# EAGLE board SparkFun_Artemis_Global_Tracker (EAGLE 9.6.2)
REVISION: A
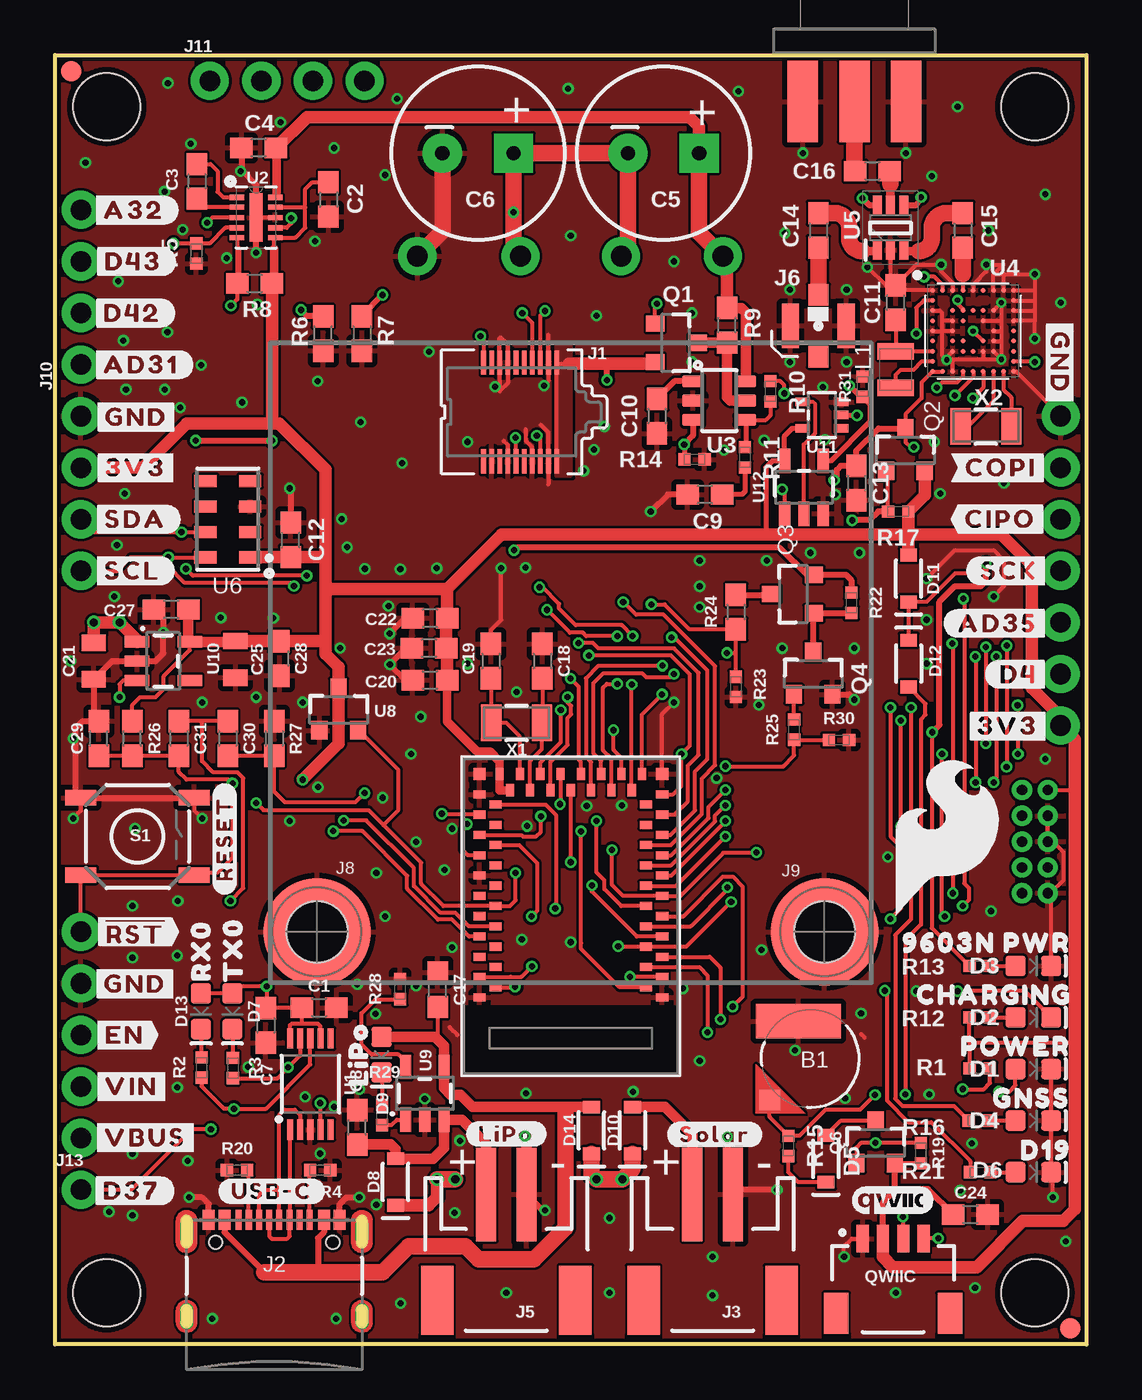
[diagram p2: board, top side]
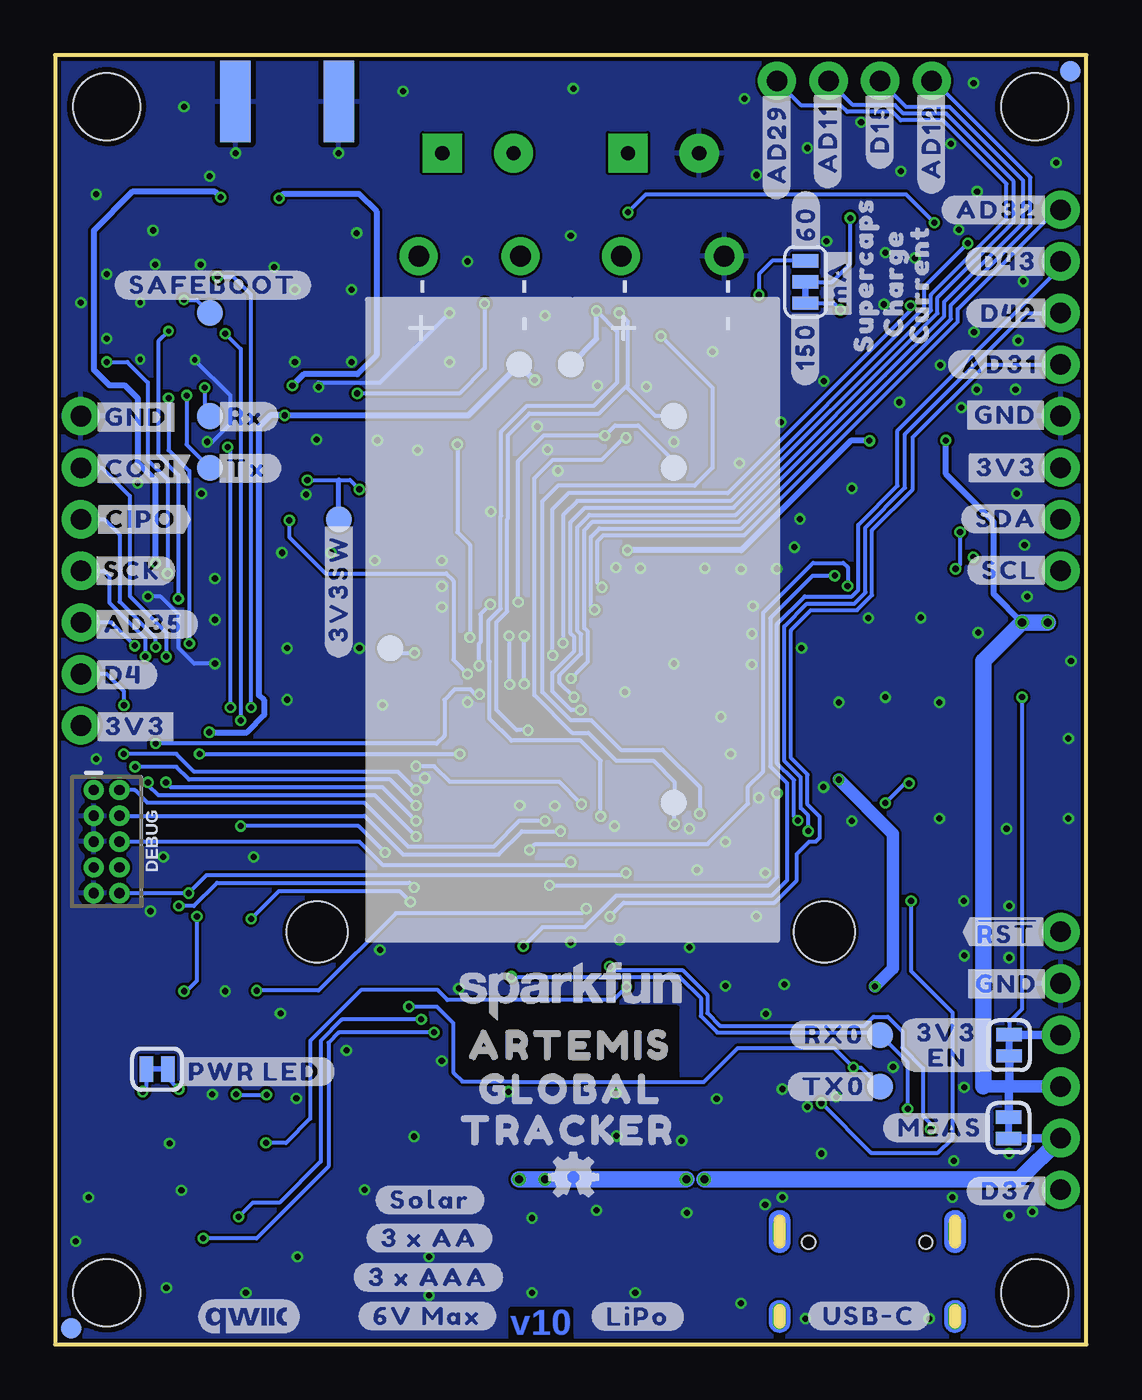
[diagram p3: board, bottom side, seen from below]

Size 50.8 x 63.5 mm. Coordinates in mm from the lower left corner, seen from the top.
Outline: 0,0 0,63.5 50.8,63.5 50.8,0 0,0
Copper layers (1*16): Top 0.035mm / dielectric 1.5mm / Bottom 0.035mm
Design rules "SparkFun-2-Layer-Minimum-JLCPCB": minimum track width 5mil, minimum drill 0.3mm, track to track 5mil, track to pad 5mil, pad to pad 5mil, via to via 5mil, smd to smd 5mil, copper to edge 7mil, drill to drill 7mil, minimum pad ring 5mil, minimum via ring 5mil, stop-mask expansion 2.5mil, vias tented up to drill 25mil, thermal gap 10mil
Net classes: 1 3.3V: width 0.203 mm
tRestrict: area 20.2,13.4 to 30.6,16.6; area 22.1,48.3 to 22.1,48.4
bRestrict: area 20.2,13.4 to 30.6,16.6

## Footprints (pad centres in the part's own frame; a part is rotated, then mirrored left to right if it is on the bottom)
SMT-JUMPER_2_NC_TRACE_SILK = smd 0.66 x 1.27: 1 -0.521,0; 2 0.521,0
PAD.03X.05 = smd 1.27 x 1.27: 1 0,0
1X01_NO_SILK = drill 1.016 pad 1.88: 1 0,0
ML414H_IV01E = smd 1 x 1: + 2.022,2.032 | smd 4.2 x 1.7: - 0.6,-1.85
0603 = smd 1.1 x 1: 1 -0.85,0; 2 0.85,0
CPOL-RADIAL-1F-2.7V = drill 0.7 pad 1.93 square: + 1.75,0 | drill 0.7 pad 1.93: - -1.75,0
0805 = smd 0.8 x 1.2: 1 -0.9,0; 2 0.9,0
LED-0603 = smd 1 x 1: A -0.877,0; C 0.877,0
SOD-323 = smd 0.63 x 0.83: A 1.15,0; C -1.15,0
2X5-PTH-1.27MM-NO_SILK = drill 0.508 pad 1: 1 -2.54,-0.635; 2 -2.54,0.635; 3 -1.27,-0.635; 4 -1.27,0.635; 5 0,-0.635; 6 0,0.635; 7 1.27,-0.635; 8 1.27,0.635; 9 2.54,-0.635; 10 2.54,0.635
1X04_NO_SILK = drill 1.016 pad 1.88: 1 0,0; 2 2.54,0; 3 5.08,0; 4 7.62,0
IRIDIUM_9603N = smd 0.23 x 1.2: 1 1.8,2.435; 2 1.8,-2.435; 3 1.4,2.435; 4 1.4,-2.435; 5 1,2.435; 6 1,-2.435; 7 0.6,2.435; 8 0.6,-2.435; 9 0.2,2.435; 10 0.2,-2.435; 11 -0.2,2.435; 12 -0.2,-2.435; 13 -0.6,2.435; 14 -0.6,-2.435; 15 -1,2.435; 16 -1,-2.435; 17 -1.4,2.435; 18 -1.4,-2.435; 19 -1.8,2.435; 20 -1.8,-2.435
USB-C-16P-2LAYER-PADS = smd 0.3 x 1: A5 -1.25,-0.34; A6 -0.25,-0.34; A7 0.25,-0.34; A8 1.25,-0.34; B5 1.75,-0.34; B6 0.75,-0.34; B7 -0.75,-0.34; B8 -1.75,-0.34 | smd 0.6 x 1: GND -3.225,-0.34; GND2 3.225,-0.34; VBUS1 -2.45,-0.34; VBUS2 2.45,-0.34 | drill 0.4 pad 0.6 long: SHLD1 -4.318,-0.915; SHLD2 4.318,-0.915; SHLD3 -4.318,-5.095; SHLD4 4.318,-5.095 | hole 0.65: -2.89,-1.445; 2.89,-1.445
JST-2-SMD = smd 1 x 4.6: 1 -1,-3.7; 2 1,-3.7 | smd 1.6 x 3.4: NC1 -3.4,1.5; NC2 3.4,1.5
1X02_NO_SILK = drill 1.016 pad 1.88: 1 0,0; 2 2.54,0
U.FL = smd 2.2 x 0.85: 1 0,1.375; 2 0,-1.375 | smd 1.05 x 1: FEED 1.525,0; NC -1.525,0
SMA-EDGE = smd 1.5 x 4: GND@0 -2.54,0; GND@1 2.54,0; SIG 0,0 | smd 1.5 x 4 bottom: GND@2 -2.54,0; GND@3 2.54,0
STAND-OFF-REFLOW-M2.0 = smd 5.3 x 5.3: 1 0,0 | hole 3: 0,0
SMT-JUMPER_3_1-NC_TRACE_SILK = smd 0.66 x 1.27: 1 -1.041,0; 2 0,0; 3 1.041,0
FIDUCIAL-1X2 = smd 1 x 1: 1 0,0
STAND-OFF = hole 3.302: 0,0
0806 = smd 0.8 x 1.8: 1 -0.9,0; 2 0.9,0
SOT23-3 = smd 0.8 x 0.9: 1 -0.95,-1; 2 0.95,-1; 3 0,1.1
JST04_1MM_RA = smd 0.6 x 1.35: 1 -1.5,0; 2 -0.5,0; 3 0.5,0; 4 1.5,0 | smd 1.2 x 2: NC1 2.8,-3.675; NC2 -2.8,-3.675
0402-TIGHT = smd 0.6 x 0.6: 1 -0.5,0; 2 0.5,0
TACTILE_SWITCH_SMD_5.2MM = smd 1.524 x 0.762: 1 -2.794,1.905; 2 2.794,1.905; 3 -2.794,-1.905; 4 2.794,-1.905
1X07_NO_SILK = drill 1.016 pad 1.88: 1 0,0; 2 2.54,0; 3 5.08,0; 4 7.62,0; 5 10.16,0; 6 12.7,0; 7 15.24,0
MSOP10 = smd 1 x 0.3: 1 -2.25,1; 2 -2.25,0.5; 3 -2.25,0; 4 -2.25,-0.5; 5 -2.25,-1; 6 2.25,-1; 7 2.25,-0.5; 8 2.25,0; 9 2.25,0.5; 10 2.25,1
DFN300X200-10L = smd 0.711 x 0.254: 1 -0.94,0.991; 2 -0.94,0.508; 3 -0.94,0; 4 -0.94,-0.508; 5 -0.94,-0.991; 6 0.94,-0.991; 7 0.94,-0.508; 8 0.94,0; 9 0.94,0.508; 10 0.94,0.991 | smd 0.635 x 2.388: 11 0,0
TSOT6 = smd 0.6 x 1.05: 1 -0.95,-1.3; 2 0,-1.3; 3 0.95,-1.3; 4 0.95,1.3; 5 0,1.3; 6 -0.95,1.3
UBLOX_ZOE_M8-0-10 = smd 0.25 x 0.25: 1 -1.996,2.004; 2 -1.496,2.004; 3 -0.996,2.004; 4 -0.496,2.004; 5 0.004,2.004; 6 0.504,2.004; 7 1.004,2.004; 8 1.504,2.004; 9 2.004,2.004; 10 2.004,1.504; 11 2.004,1.004; 12 2.004,0.504; 13 2.004,0.004; 14 2.004,-0.496; 15 2.004,-0.996; 16 2.004,-1.496; 17 2.004,-1.996; 18 1.504,-1.996; 19 1.004,-1.996; 20 0.504,-1.996; 21 0.004,-1.996; 22 -0.496,-1.996; 23 -0.996,-1.996; 24 -1.496,-1.996; 25 -1.996,-1.996; 26 -1.996,-1.496; 27 -1.996,-0.996; 28 -1.996,-0.496; 29 -1.996,0.004; 30 -1.996,0.504; 31 -1.996,1.004; 32 -1.996,1.504; 33 -0.996,1.004; 34 -0.496,1.004; 35 0.004,1.004; 36 0.504,1.004; 37 1.004,1.004; 38 1.004,0.004; 39 1.004,-0.496; 40 1.004,-0.996; 41 0.504,-0.996; 42 0.004,-0.996; 43 -0.496,-0.996; 44 -0.996,-0.996; 45 -0.996,-0.496; 46 -0.996,0.004; 47 -0.996,0.504; 48 -0.496,0.504; 49 0.504,0.504; 50 0.504,-0.496; 51 -0.496,-0.496
SOT65P220X100-6N = smd 0.95 x 0.45: 1 -1.1,0.65; 2 -1.1,0; 3 -1.1,-0.65; 4 1.1,-0.65; 5 1.1,0; 6 1.1,0.65
MS8607-02BA01 = smd 1.1 x 0.6: 1 -1.1,1.875; 2 -1.1,0.625; 3 -1.1,-0.625; 4 -1.1,-1.875; 5 1.1,-1.875; 6 1.1,-0.625; 7 1.1,0.625; 8 1.1,1.875
ARTEMIS_FP = smd 0.4 x 0.6: AD16 -4,-3.7; BOOT 1.5,4.5; D0 0.5,-4.5; D1 -0.5,-4.5; D2 -1,-3.7; D3 2,-3.7; D7 -1.5,4.5; D8 -0.5,4.5; D9 2,3.7; D10 1,3.7; D14 -5,3.7; D17 -3.5,-4.5; D36 2.5,-4.5; D38 3,-3.7; D40 2.5,4.5; D41 -2.5,-4.5; GND@1 4.5,4.5; GND@39 -5.5,-4.5; GND@47 -1.5,-4.5; GND@59 4.5,-4.5; RXI-0 3.5,4.5; SWDCK 4,3.7; SWDIO 0,3.7; TXO-0 0.5,4.5; ~AD31 -3,-3.7; ~AD35 -2,3.7; ~D4 -2.5,4.5; ~D5 -1,3.7; ~D18 -4.5,-4.5; ~D19 -5,-3.7; ~D22 -3.5,4.5; ~D23 -4,3.7; ~D24 -3,3.7; ~D27 -4.5,4.5; ~D28 -5.5,4.5; ~D37 3.5,-4.5; ~D39 3,3.7; ~D42 1.5,-4.5; ~D43 1,-3.7; ~D44 4,-3.7; ~D45 -2,-3.7; ~RST 0,-3.7 | smd 0.6 x 0.4: AD34 -6.5,-0.5; D15 -6.5,0.5; VDD@36 -5.7,-3; VDD@37 -6.5,-3.5; XI -6.5,-2.5; XO -5.7,-2; ~AD11 -5.7,-1; ~AD12 -5.7,2; ~AD13 -5.7,1; ~AD29 -6.5,-1.5; ~AD32 -5.7,3; ~AD33/SWO -5.7,0; ~D6 -6.5,3.5; ~D25 -6.5,2.5; ~D26 -6.5,1.5 | smd 0.6 x 0.6: GND@22 -6.5,4.5; GND@38 -6.5,-4.5
SOT23-5 = smd 0.55 x 1.2: 1 -0.95,-1.3; 2 0,-1.3; 3 0.95,-1.3; 4 0.95,1.3; 5 -0.95,1.3
SOT353 = smd 0.42 x 0.7: 1 -0.65,-0.95; 2 0,-0.95; 3 0.65,-0.95; 4 0.65,0.95; 5 -0.65,0.95
CRYSTAL-SMD-3.2X1.5MM = smd 1 x 1.8: P$1 -1.25,0; P$2 1.25,0

## Placement (x,y rotation side)
3V3EN  JUMPER-SMT_2_NC_TRACE_SILK  [SMT-JUMPER_2_NC_TRACE_SILK]  3.81,14.73 90 bottom
3V3SW  [PAD.03X.05]  36.83,40.64 0 bottom
5V3  TEST-POINT3X5  [PAD.03X.05]  27.94,48.26 0 bottom
!RESET  [1X01_NO_SILK]  1.27,20.32 0 top
B1  ML414H_IV01E_BATTERY  [ML414H_IV01E]  37.21,14.07 180 top
C1  10nF  [0603]  13,16.59 0 top
C2  2.2uF  [0603]  13.46,56.39 270 top
C3  1.0uF  [0603]  6.99,57.28 270 top
C4  0.22uF  [0603]  10.03,58.93 180 top
C5  1F 2.7V  [CPOL-RADIAL-1F-2.7V]  29.97,58.67 0 top
C6  1F 2.7V  [CPOL-RADIAL-1F-2.7V]  20.83,58.67 0 top
C7  0.1uF  [0603]  10.38,15.71 270 top
C8  4.7uF  [0603]  14.88,10.69 90 top
C9  10nF  [0603]  32,41.86 180 top
C10  1.0uF  [0603]  29.64,45.72 270 top
C11  4.7uF  [0603]  41.4,51.31 90 top
C12  0.22uF  [0603]  11.61,39.62 90 top
C13  0.1uF  [0603]  39.47,42.42 270 top
C14  100pF  [0603]  37.59,54.86 270 top
C15  100pF  [0603]  44.7,54.86 270 top
C16  100pF  [0603]  40.26,57.78 0 top
C17  4.7uF  [0603]  18.85,17.48 90 top
C18  15pF  [0603]  24,33.66 270 top
C19  15pF  [0603]  21.46,33.66 270 top
C20  0.1uF  [0603]  18.47,32.72 0 top
C21  22uF  [0805]  1.91,33.66 270 top
C22  10uF  [0603]  18.47,35.76 180 top
C23  1.0uF  [0603]  18.41,34.29 180 top
C24  1.0uF  [0603]  45.09,6.4 0 top
C25  22uF  [0805]  8.89,33.74 270 top
C27  1.0uF  [0603]  5.71,36.2 180 top
C28  0.1uF  [0603]  11.05,33.78 270 top
C29  1nF  [0603]  2.16,29.84 90 top
C30  0.1uF  [0603]  8.51,29.84 270 top
C31  0.1uF  [0603]  6.1,29.84 270 top
D1  GREEN  [LED-0603]  48.18,13.56 0 top
D2  Yellow  [LED-0603]  48.18,16.1 0 top
D3  RED  [LED-0603]  48.18,18.64 0 top
D4  BLUE  [LED-0603]  48.18,11.02 0 top
D5  0.5A/40V/420mV  [SOD-323]  37.97,9.14 90 top
D6  WHITE  [LED-0603]  48.18,8.48 0 top
D7  GREEN  [LED-0603]  8.74,16.41 270 top
D8  0.5A/40V/420mV  [SOD-323]  16.76,8 90 top
D9  Yellow  [LED-0603]  16.08,14.27 270 top
D10  0.5A/40V/420mV  [SOD-323]  28.45,10.54 90 top
D11  0.5A/40V/420mV  [SOD-323]  42.04,37.72 90 top
D12  0.5A/40V/420mV  [SOD-323]  42.04,33.53 270 top
D13  Yellow  [LED-0603]  7.19,16.41 270 top
D14  0.5A/40V/420mV  [SOD-323]  26.42,10.54 90 top
D17  [PAD.03X.05]  25.4,48.26 0 bottom
D41  [PAD.03X.05]  20.32,26.67 0 bottom
DEBUG  CORTEX_DEBUG  [2X5-PTH-1.27MM-NO_SILK]  48.26,24.77 270 bottom
EN  [1X01_NO_SILK]  1.27,15.24 0 top
FRAME3  FRAME-LETTERNO_PACKAGE  [DUMMY]  -7.62,-40.64 0 top  (outside the outline)
FRAME5  FRAME-LEDGER  [CREATIVE_COMMONS]  -7.62,-40.64 0 top  (outside the outline)
GND  [1X01_NO_SILK]  1.27,17.78 0 top
GPS_RX  TEST-POINT3X5  [PAD.03X.05]  43.18,45.72 0 bottom
GPS_TX  TEST-POINT3X5  [PAD.03X.05]  43.18,43.18 0 bottom
I2C  PTH  [1X04_NO_SILK]  1.27,45.72 270 top
J1  IRIDIUM_9603N  [IRIDIUM_9603N]  22.9,45.92 0 top
J2  USB-C  [USB-C-16P-2LAYER-PADS]  10.79,6.48 0 top
J3  [JST-2-SMD]  32.38,3.68 180 top
J4  [1X02_NO_SILK]  1.27,12.7 270 top
J5  [JST-2-SMD]  22.23,3.68 180 top
J6  U.FL  [U.FL]  37.59,50.16 90 top
J7  ANTENNA-GROUNDEDEDGE_SMA  [SMA-EDGE]  39.37,61.21 0 top
J8  STAND-OFF-REFLOW-M2.0_6.0MM_TALL  [STAND-OFF-REFLOW-M2.0]  12.9,20.32 0 top
J9  STAND-OFF-REFLOW-M2.0_6.0MM_TALL  [STAND-OFF-REFLOW-M2.0]  37.9,20.32 0 top
J10  [1X04_NO_SILK]  1.27,48.26 90 top
J11  [1X04_NO_SILK]  7.62,62.23 0 top
J13  [1X01_NO_SILK]  1.27,7.62 0 top
JP1  JUMPER-SMT_3_1-NC_TRACE_SILK  [SMT-JUMPER_3_1-NC_TRACE_SILK]  13.84,52.32 270 bottom
JP2  JUMPER-SMT_2_NC_TRACE_SILK  [SMT-JUMPER_2_NC_TRACE_SILK]  45.77,13.56 0 bottom
JP7  FIDUCIAL1X2  [FIDUCIAL-1X2]  0.79,62.71 0 bottom
JP8  FIDUCIAL1X2  [FIDUCIAL-1X2]  50.01,0.79 0 top
JP9  STAND-OFF  [STAND-OFF]  2.54,60.96 0 top
JP10  STAND-OFF  [STAND-OFF]  48.26,60.96 0 top
JP11  STAND-OFF  [STAND-OFF]  2.54,2.54 0 top
JP12  STAND-OFF  [STAND-OFF]  48.26,2.54 0 top
JP13  FIDUCIAL1X2  [FIDUCIAL-1X2]  50.01,0.79 0 bottom
JP14  FIDUCIAL1X2  [FIDUCIAL-1X2]  0.79,62.71 0 top
L1  2.2uH  [0806]  41.4,48.01 270 top
LOGO1  SFE_LOGO_NAME.1_INCH  [SFE_LOGO_NAME_.1]  25.4,17.4 0 bottom
LOGO2  SFE_LOGO_FLAME.3_INCH  [SFE_LOGO_FLAME_.3]  43.95,24.93 0 top
LOGO4  OSHW-LOGOMINI  [OSHW-LOGO-MINI]  25.27,8.26 0 bottom
MEAS  JUMPER-SMT_2_NC_TRACE_SILK  [SMT-JUMPER_2_NC_TRACE_SILK]  3.84,10.67 90 bottom
Q1  5.8A/30V/35mΩ  [SOT23-3]  30.56,49.33 270 top
Q2  20V/4.2A/52mΩ/1.4W  [SOT23-3]  41.88,44.02 0 top
Q3  20V/4.2A/52mΩ/1.4W  [SOT23-3]  36.37,36.96 90 top
Q4  600mA/40V  [SOT23-3]  37.34,33.02 0 top
Q6  20V/4.2A/52mΩ/1.4W  [SOT23-3]  40.41,9.93 0 top
QWIIC  QWIIC_RA  [JST04_1MM_RA]  41.27,5.21 0 top
R1  330  [0402-TIGHT]  45.54,13.59 180 top
R2  1k  [0402-TIGHT]  7.21,13.64 90 top
R3  1k  [0402-TIGHT]  8.76,13.61 90 top
R4  5.1k  [0402-TIGHT]  13.06,8.59 180 top
R5  10K  [0402-TIGHT]  6.96,53.72 90 top
R6  12k  [0603]  13.21,49.78 90 top
R7  30.1k  [0603]  15.11,49.78 270 top
R8  100k  [0603]  9.83,52.25 0 top
R9  0.015ohm  [0603]  33.1,50.19 90 top
R10  100  [0402-TIGHT]  35.23,46.94 270 top
R11  100  [0402-TIGHT]  33.99,43.69 270 top
R12  1k  [0402-TIGHT]  45.54,16.1 180 top
R13  2.0K  [0402-TIGHT]  45.54,18.64 180 top
R14  10K  [0402-TIGHT]  31.5,43.59 0 top
R15  3.3K  [0402-TIGHT]  36.12,9.78 270 top
R16  1k  [0402-TIGHT]  45.49,11.02 180 top
R17  10K  [0402-TIGHT]  41.53,41.02 0 top
R19  10K  [0402-TIGHT]  42.65,9.42 270 top
R20  5.1k  [0402-TIGHT]  8.97,8.59 0 top
R21  1k  [0402-TIGHT]  45.57,8.48 180 top
R22  10K  [0402-TIGHT]  39.22,36.53 90 top
R23  10K  [0402-TIGHT]  33.53,32.38 270 top
R24  20k  [0603]  33.53,36.07 270 top
R25  1k  [0402-TIGHT]  36.4,30.28 90 top
R26  100k  [0603]  3.81,29.84 90 top
R27  220k  [0603]  10.79,29.84 270 top
R28  2.0K  [0402-TIGHT]  16.99,17.5 270 top
R29  1k  [0402-TIGHT]  16.1,11.3 90 top
R30  10K  [0402-TIGHT]  38.61,29.77 0 top
R31  20k  [0402-TIGHT]  39.78,47.17 90 top
RX0  TEST-POINT3X5  [PAD.03X.05]  10.16,15.24 0 bottom
RX1  TEST-POINT3X5  [PAD.03X.05]  20.32,45.72 0 bottom
S1  RESET  [TACTILE_SWITCH_SMD_5.2MM]  4.06,25.02 0 top
SAFEBOOT  TEST-POINT3X5  [PAD.03X.05]  43.18,50.8 0 bottom
SC1+  [1X01_NO_SILK]  32.89,53.59 0 top
SC1-  [1X01_NO_SILK]  27.88,53.59 0 top
SC2+  [1X01_NO_SILK]  22.92,53.59 0 top
SC2-  [1X01_NO_SILK]  17.84,53.59 0 top
SPI  [1X07_NO_SILK]  49.53,45.72 270 top
TX0  TEST-POINT3X5  [PAD.03X.05]  10.16,12.7 0 bottom
TX1  TEST-POINT3X5  [PAD.03X.05]  20.32,43.18 0 bottom
U1  CH340E_MSOP10  [MSOP10]  12.57,12.83 90 top
U2  LTC3225EDDB  [DFN300X200-10L]  9.91,55.5 0 top
U3  ADM4210_1TSOT6  [TSOT6]  32.72,46.48 270 top
U4  u-blox_ZOE_M8Q-0-10  [UBLOX_ZOE_M8-0-10]  45.21,49.91 0 top
U5  AS179-92LF  [SOT65P220X100-6N]  41.15,54.99 90 top
U6  MS8607-02BA01  [MS8607-02BA01]  8.51,40.64 180 top
U7  ARTEMIS_MODULESMD  [ARTEMIS_FP]  25.4,21.59 270 top
U8  V_SUPERVISOR_BD48K24G_2.4V  [SOT23-3]  13.97,31.24 0 top
U9  MCP73831  [SOT23-5]  18.21,12.37 0 top
U10  3.3V  [SOT23-5]  5.33,33.66 270 top
U11  74LVC1G04SE  [SOT353]  37.77,45.77 90 top
U12  74LVC1G08W5-7  [SOT23-5]  36.88,42.21 0 top
U$1  [SUPERCAPACITOR151]  32.05,35.59 90 bottom
U$2  [#SCK#199608]  46.99,38.1 0 bottom
U$3  [#3V3#0]  3.94,43.18 0 bottom
U$4  [#SDA#0]  3.94,40.67 0 bottom
U$5  [#USB#C#0]  10.72,1.4 0 bottom
U$6  [#SCL#0]  3.78,38.13 0 bottom
U$7  [#VIN#158]  3.76,12.7 0 top
U$8  [#3V3SW#0]  36.83,37.24 90 bottom
U$9  [CHARGING9604]  46.26,17.22 0 top
U$10  [#COPI#9694]  46.58,43.18 0 top
U$11  [QWIIC_4MM]  41.26,7.09 0 top
U$12  [LIPO5]  14.94,14.3 90 top
U$13  [SUPERCAPACITOR151]  22.07,35.99 90 bottom
U$14  [10F_2#7V152]  29.41,35.94 90 bottom
U$15  [10F_2#7V152]  19.48,35.64 90 bottom
U$16  [RX06]  7.2,19.41 90 top
U$17  [#3V3#153]  3.96,43.18 0 top
U$18  [TX07]  8.77,19.44 90 top
U$19  [#AD35#199609]  46.43,35.51 0 top
U$20  [#GND#0]  46.81,45.67 0 bottom
U$21  [#SDA#153]  3.96,40.64 0 top
U$22  [#SCL#154]  3.81,38.1 0 top
U$24  [#AD31#7]  4.24,48.25 0 top
U$25  [QWIIC_5MM]  41.27,1.4 0 bottom
U$26  [#_RST##156]  3.78,20.32 0 top
U$27  [#EN#157]  3.43,15.24 0 top
U$28  [#VIN#3#0]  34.32,31.29 90 bottom
U$29  [#AD35#0]  46.43,35.48 0 bottom
U$30  [ARTEMIS0]  25.4,14.73 0 bottom
U$31  [SUPERCAPS6]  10.97,52.68 90 bottom
U$32  [#D17#0]  23.37,48.21 0 bottom
U$33  [#SAFEBOOT#0]  43.03,52.17 0 bottom
U$34  [#TX0#0]  12.45,12.7 0 bottom
U$35  [#TX1#0]  18.08,43.15 0 bottom
U$36  [#GND#0]  3.99,45.77 0 bottom
U$37  [#RX#0]  41.4,45.69 0 bottom
U$38  [#RX1#0]  18.14,45.67 0 bottom
U$39  [#TX#0]  41.35,43.15 0 bottom
U$40  [#5#3V#0]  27.97,45.85 90 bottom
U$41  [#D41#0]  18.19,26.62 0 bottom
U$42  [#RX0#0]  12.42,15.24 0 bottom
U$43  [#3V3#0]  46.84,30.43 0 bottom
U$44  [#RESET#162]  8.36,24.89 90 top
U$45  [#SOLAR#165]  32.49,10.34 0 top
U$46  [#LIPO#164]  22.23,10.36 0 top
U$47  [#MEAS#0]  7.21,10.67 0 bottom
U$48  [#3V3_#0]  6.73,15.34 0 bottom
U$50  [#D4#36]  47.42,32.98 0 bottom
U$51  [GLOBAL0]  25.4,12.57 0 bottom
U$52  [TRACKER0]  25.53,10.54 0 bottom
U$53  [#LIPO#0]  22.1,1.37 0 bottom
U$54  [#_EN_#0]  6.86,14.12 0 bottom
U$55  [#SOLAR#0]  32.33,7.11 0 bottom
U$56  [#USB#C#161]  10.67,7.54 0 top
U$57  [#3_X_AA#0]  32.36,5.23 0 bottom
U$58  [#VBUS#159]  4.45,10.19 0 top
U$59  [#AD32#152]  4.41,55.88 0 bottom
U$60  [#SCK#9696]  46.99,38.1 0 top
U$61  [#PWR_LED#0]  41,13.44 0 bottom
U$63  [#D4#5]  47.45,33 0 top
U$64  [#CIPO#2]  46.56,40.64 0 bottom
U$65  [#3_X_AAA#0]  32.41,3.3 0 bottom
U$66  [#6V_MAX#0]  32.46,1.4 0 bottom
U$67  [CHARGE8]  9.49,52.28 90 bottom
U$69  [CURRENT9]  8.22,52.23 90 bottom
U$70  [#3V3#153]  46.91,30.45 0 top
U$71  [#D42#32]  3.8,50.79 0 top
U$72  [#D37#152]  3.77,7.57 0 top
U$73  [#D43#43]  3.85,53.33 0 top
U$74  [#150#61]  13.86,49.16 90 bottom
U$75  [#COPI#5]  46.58,43.13 0 bottom
U$76  [#GND#152]  3.99,45.67 0 top
U$77  [#GND#152]  3.94,17.75 0 top
U$78  [#GND#152]  49.48,48.36 270 top
U$79  [#A32#44]  3.89,55.86 0 top
U$80  [#MA#45]  12.26,52.25 90 bottom
U$81  [#60#46]  13.82,55.2 90 bottom
U$82  [#D43#151]  3.85,53.33 0 bottom
U$83  [#D42#151]  3.8,50.79 0 bottom
U$84  [#AD31#151]  4.25,48.26 0 bottom
U$85  [#AD12#151]  7.65,59.27 90 bottom
U$86  [#D15#151]  10.18,59.87 90 bottom
U$87  [#AD11#151]  12.74,59.4 90 bottom
U$88  [#AD29#151]  15.26,59.1 90 bottom
U$89  [#CIPO#151]  46.56,40.65 0 top
U$90  [#D37#0]  3.79,7.56 0 bottom
U$91  [#GND#38]  3.93,17.75 0 bottom
U$92  [##RST##39]  3.94,20.33 0 bottom
U$93  [9603N_PWR40]  45.88,19.78 0 top
U$94  [POWER9605]  47.31,14.68 0 top
U$95  [GNSS9606]  48.1,12.12 0 top
U$96  [D199607]  48.8,9.57 0 top
VIN/3  TEST-POINT3X5  [PAD.03X.05]  34.29,34.29 270 bottom
X1  32.768kHz  [CRYSTAL-SMD-3.2X1.5MM]  22.73,30.61 0 top
X2  32.768kHz  [CRYSTAL-SMD-3.2X1.5MM]  45.85,45.21 0 top

## Tracks (layer width: path | path; a pad name or v marks a point on that pad's centre or on a via)
3.3V  (via drill 0.3)
  Top 0.203: 10.79,53.98 10.79,54.46 U2.6 11.84,54.51 12.32,54.99 12.32,56.01 | C2.1 12.66,57.24 12.32,56.9 12.32,56.01 | U2.9 12.32,56.01 | D13.A D7.A 9.08,17.63 v10.41,17.63 10.41,16.6 C7.1 10.4,16.59 C1.1 12.15,15.82 12.17,15.81 | U1.7 13.07,15.67 12.94,15.81 12.17,15.81 | R26.2 3.81,31.5 4.19,31.88 4.95,31.88 5.36,32.28 5.36,32.92 6.63,34.19 U10.5 | DEBUG.1 50.22,27.3 | 45.04,14.86 R12.2 | 50.22,14.86 45.04,14.86 | 45.04,14.86 R1.2 | 41.36,7.67 41.36,7.62 41.36,7.58 | Q6.2 R19.2 | U1.10 11.57,15.71 11.66,15.81 12.17,15.81
  Top 0.254: U11.5 36.31,45.12 35.93,44.74 U12.5 35.32,43.52 35,43.2 35,40.03 35.15,39.88
  Top 0.305: R8.2 10.79,52.36 | QWIIC.2 40.77,6.99 41.36,7.58 | C24.1 42.99,7.64 41.39,7.64 41.36,7.67 | 41.36,7.62 Q6.2
  Top 0.406: 19.32,34.24 C23.1 | 10.79,52.36 10.79,53.98 | U7.VDD@36 21.89,27.29 U7.VDD@37 21.9,28.72 21.41,29.21 20.78,29.21 19.32,30.67 C20.2
  Top 0.508: C27.1 6.57,34.67 U10.5 8.87,34.6 C25.1
  Top 0.61: C20.2 19.32,34.24 | C23.1 19.27,35.71 C22.1 19.32,37.21 | 13.32,37.21 13.31,37.21 13.31,38.77 | 13.32,37.21 19.32,37.21 | D11.A 42.02,38.88 42.02,39.88 | 42.03,39.88 46.61,39.88 48.11,38.37 48.11,32.33 49.53,30.91 SPI.7 50.22,29.79 50.22,27.3 50.22,14.86 50.22,6.66 49.66,6.1 47.68,6.1 45.39,3.81 41.27,3.81 40.77,4.31 QWIIC.2 | 42.02,39.88 42.03,39.88 | I2C.2 4.32,43.18 6.48,45.34 10.68,45.34 | R8.2 10.68,45.34 | 19.32,37.21 21.98,39.88 35.15,39.88 42.02,39.88 | v12.19,27.81 13.97,29.59 U8.3 13.97,33.35 13.32,34 13.32,34.63 | 13.32,34.63 13.32,37.21 | 42.03,39.88 R17.2 42.83,41.82 Q2.2 | 13.31,38.77 13.31,43.07 11.05,45.34 10.68,45.34 | 13.31,38.77 C12.1 U6.1 | 13.32,34.63 C28.1 C25.1
  Bottom 0.61: v12.19,27.81 9.53,25.15 9.53,18.52 v10.41,17.63
3V3SW  (via drill 0.3)
  Top 0.203: U4.24 U4.25 42.67,47.37 42.67,46.6 41.88,45.81 Q2.3 | R16.2 44.28,11.73 41.75,11.73 41.38,12.1 41.38,20.17 42.16,20.95 v42.16,31.37 | v35.81,42.11 35.93,42 U12.1 | Q2.3 41.88,44.45 42.14,44.19 v42.3,44.19
  Top 0.305: Q2.3 40.56,45.11 39.47,44.01 C13.1 38.7,43.27 38.5,43.07 38.5,42.69 v38.38,42.57
  Bottom 0.203: v42.16,31.37 42.16,44.05 v42.3,44.19 | v38.38,42.57 36.83,42.57 36.27,42.57 v35.81,42.11
  Bottom 0.254: 3V3SW.1 36.83,42.57
ANTENNA
  Top 0.813: 39.37,57.82 C16.1 39.37,57.82 | 39.37,57.82 J7.SIG
ARTEMIS_!RESET  (via drill 0.3)
  Top 0.203: C29.1 R26.1 C31.2 6.1,28.19 6.48,27.81 8.56,27.81 v8.74,27.64 8.74,23.98 8,23.24 6.99,23.24 S1.4 S1.3 !RESET.1 | 16.18,25.58 18.03,23.73 18.03,22.68 19.13,21.59 U7.~RST 22.4,21.59 22.68,21.87 v22.68,23.22 | v9.91,26.67 10.26,26.31 15.44,26.31 16.18,25.57 16.18,25.58 | U4.20 45.72,47.11 v45.21,46.61 | v44.19,34.52 44.21,34.49 v44.21,22.24 v44.22,22.23 | U8.2 14.97,30.24 16.89,28.32 16.89,26.29 16.18,25.58
  Bottom 0.203: v9.91,26.67 8.94,27.64 v8.74,27.64 | DEBUG.10 v44.22,22.23 43.34,23.11 22.78,23.11 v22.68,23.22 | v45.21,46.61 45.21,44.04 44.19,43.02 v44.19,34.52
ARTEMIS_!RTS!  (via drill 0.3)
  Top 0.203: 7.15,30.7 7.24,30.61 7.24,28.73 7.8,28.17 8.99,28.17 9.27,27.89 9.27,22.48 v8.64,21.84 | 7.15,30.7 C31.1 | C30.1 7.15,30.7 | U1.4 13.07,11.88 v13.06,11.89
  Bottom 0.203: v13.06,11.89 10.61,9.44 7.31,9.44 6.59,10.15 6.59,16.33 8.64,18.37 v8.64,21.84
ARTEMIS_AD11  (via drill 0.3)
  Top 0.203: U7.~AD11 24.4,28.68 25.24,29.52 25.24,30.85 25.42,31.03 25.42,31.45 25.24,31.63 v25.24,31.88
  Bottom 0.203: v25.24,31.88 25.94,32.58 25.94,32.97 24.89,34.02 24.89,34.97 25.07,35.15 25.07,40.25 24.48,40.85 17.27,40.85 7.33,50.79 7.33,51.56 3.58,55.3 3.58,57.29 6.91,60.61 9.01,60.61 9.43,61.03 11.5,61.03 J11.3
ARTEMIS_AD12  (via drill 0.3)
  Top 0.203: U7.~AD12 27.4,28.86 27,29.26 27,32.35 27.18,32.53 v27.7,32.53 | v27.7,34.88 26.16,34.88 25.99,35.05 25.36,35.05 v24.23,36.19
  Bottom 0.203: v27.7,32.53 v27.7,34.88 | v24.23,36.19 24.4,36.36 24.4,39.77 23.99,40.19 16.99,40.19 6.67,50.51 6.67,51.19 2.76,55.1 2.76,57.48 7.51,62.23 J11.1
ARTEMIS_AD29  (via drill 0.3)
  Top 0.203: U7.~AD29 23.9,28.65 24.91,29.66 v24.91,31.24
  Bottom 0.203: v24.91,31.24 25.38,31.24 26.31,32.17 26.31,33.07 25.22,34.15 25.22,34.83 25.4,35.01 25.4,40.5 24.69,41.21 17.38,41.21 7.66,50.92 7.66,51.69 3.95,55.41 3.95,57.16 7.07,60.28 9.15,60.28 9.57,60.7 11.79,60.7 12.1,61.02 14.03,61.02 J11.4
ARTEMIS_AD31  (via drill 0.3)
  Top 0.203: U7.~AD31 22.86,24.59 23.75,23.7 23.75,21.36 v23.47,21.08
  Bottom 0.203: v23.47,21.08 22.79,21.75 15.37,21.75 14.27,22.86 14.27,24.14 13.65,24.76 13.34,24.76 13.13,24.96 13.13,25.98 13.74,26.59 13.74,28.06 14.56,28.88 14.56,35.18 13.58,36.16 11.3,36.16 10.56,36.9 10.56,40.1 8.55,42.11 8.55,44.67 4.97,48.26 J10.1
ARTEMIS_AD32  (via drill 0.3)
  Top 0.203: U7.~AD32 28.4,32.49 v28.41,32.5 | v28.44,34.89 27.91,35.42 25.64,35.42 24.83,36.23 24.83,36.47 24.01,37.29 v23.86,37.29
  Bottom 0.203: v28.41,32.5 28.41,34.86 v28.44,34.89 | v23.86,37.29 24.07,37.5 24.07,39.57 23.79,39.85 16.86,39.85 6.34,50.37 6.34,50.99 1.45,55.88 J10.4
ARTEMIS_BOOT  (via drill 0.3)
  Top 0.203: C30.2 R27.2 10.79,27.23 11.33,26.69 14.78,26.69 v15.24,27.15 | v26.44,22.61 26.44,22.3 28.65,20.09 U7.BOOT
  Bottom 0.203: v26.44,22.61 15.67,22.61 15.24,23.03 v15.24,27.15
ARTEMIS_D4  (via drill 0.3)
  Top 0.203: v47.41,31.48 47.41,29.1 v47.42,29.08 | U7.~D4 30.34,24.09 32.18,25.93 32.18,26.47 v33.02,27.3
  Bottom 0.203: v33.02,27.3 33.91,28.19 43.94,28.19 44.83,29.08 v47.42,29.08 | v47.41,31.48 47.41,32.17 48.26,33.02 SPI.6
ARTEMIS_D5_SCK  (via drill 0.3)
  Top 0.203: v46.35,33.88 46.35,27.81 v46.23,27.69 | U7.~D5 30.59,22.59 v33.02,25.02
  Bottom 0.203: v33.02,25.02 35.05,27.05 45.72,27.05 46.23,27.56 v46.23,27.69 | SPI.4 48.39,38.1 48.13,37.85 48.13,36.53 46.35,34.76 v46.35,33.88
ARTEMIS_D6_MISO  (via drill 0.3)
  Top 0.203: U7.~D6 28.9,31.02 v29.9,32.02 | v45.85,34.35 v45.85,29.59
  Bottom 0.203: SPI.3 48.39,40.64 47.62,39.88 47.62,36.58 45.85,34.8 v45.85,34.35 | v29.9,32.02 30.11,32.02 30.35,32.26 31.11,32.26 31.62,31.75 31.62,29.97 32,29.59 v45.85,29.59
ARTEMIS_D7_MOSI  (via drill 0.3)
  Top 0.203: v45.32,33.87 45.34,33.86 v45.34,27.69 | U7.D7 30.35,23.09 33.02,25.76 v33.02,25.78
  Bottom 0.203: SPI.2 48.51,43.18 47.12,41.78 47.12,36.85 45.32,35.06 v45.32,33.87 | v33.02,25.78 34.67,27.43 45.09,27.43 v45.34,27.69 | v45.32,33.87
ARTEMIS_D8_SCL  (via drill 0.3)
  Top 0.203: U4.32 42.78,51.41 42.42,51.05 v42.42,49.78 | v41.66,25.53 v41.66,30.73 | v5.58,38.77 U6.8 | I2C.4 3.06,38.1 3.73,38.77 v5.58,38.77 | v27.43,24.36 27.43,22.63 27.97,22.09 U7.D8 30.8,22.09 32.92,24.21 34.52,24.21 v34.54,24.23 | v11.76,37.35 11.61,37.51 6.39,37.51 5.58,38.32 v5.58,38.77
  Bottom 0.203: v42.42,49.78 41.66,49.02 v41.66,30.73 | v34.54,24.23 35.84,25.53 v41.66,25.53 | v27.43,24.36 27.15,24.64 18.66,24.64 16.67,26.63 16.67,27.48 15.92,28.23 15.92,36.04 13.47,38.49 11.98,38.49 11.76,38.27 v11.76,37.35
ARTEMIS_D9_SDA  (via drill 0.3)
  Top 0.203: v6.22,40.01 6.23,40.02 | 6.23,40.02 U6.7 | I2C.3 1.9,40.02 6.23,40.02 | U4.2 43.72,52.17 43.31,52.58 v42.8,52.58 | v41.15,31.37 41.15,25.02 41.66,24.51 41.66,21.46 v41.15,20.95 | v33.3,21.79 31.1,19.59 U7.D9 29.08,19.61 v27.74,19.61 | v6.44,38.2 6.78,37.86 v12.39,37.86
  Bottom 0.203: v42.8,52.58 42.04,52.58 41.15,51.69 v41.15,31.37 | v41.15,20.95 39.78,22.33 33.83,22.33 v33.3,21.79 | v27.74,19.61 26.8,20.55 24.71,20.55 23.16,22.1 15.52,22.1 14.73,22.89 14.73,27.64 15.57,28.47 15.57,35.77 13.48,37.86 v12.39,37.86 | v6.44,38.2 6.22,38.42 v6.22,40.01
ARTEMIS_D10  (via drill 0.25, 0.3)
  Top 0.203: v44.73,36.73 44.78,36.68 44.78,22.71 45.01,22.48 45.01,21.89 v44.7,21.59 | v45.21,49.91 45.71,49.41 U4.50 | U7.D10 31.31,20.59 33.12,22.4 v33.12,22.5
  Bottom 0.203: v45.21,49.91 U4.50 45.72,43.81 44.73,42.82 v44.73,36.73 | v44.7,21.59 43.97,21.59 42.82,22.73 33.35,22.73 v33.12,22.5
ARTEMIS_D13  (via drill 0.3)
  Top 0.203: U7.~AD13 26.4,28.68 26.15,28.93 26.15,32.8 26.78,33.43 v29.92,33.43 | v29.36,36.45 30.02,36.45 31.23,35.24 33.5,35.24 R24.2 | R23.1 33.53,34.06 | 33.53,34.06 33.53,35.18 | v33.1,34.06 33.53,34.06
  Top 0.305: R24.2 33.53,35.18
  Bottom 0.203: v29.36,36.45 29.85,35.96 29.85,34.58 29.92,34.51 v29.92,33.43 | VIN/3.1 34.06,34.06 v33.1,34.06
ARTEMIS_D15  (via drill 0.3)
  Top 0.203: U7.D15 25.9,28.69 25.79,28.8 25.79,32.4 v25.39,32.8
  Bottom 0.203: v25.39,32.8 24.56,33.62 24.56,35.1 24.73,35.27 24.73,40.1 24.32,40.52 17.14,40.52 9.92,47.74 | 9.92,47.74 | 9.92,47.74 7,50.65 7,51.35 3.11,55.24 3.11,57.32 6.73,60.94 8.87,60.94 J11.2
ARTEMIS_D17  (via drill 0.3)
  Top 0.203: J1.5 23.9,50.67 v24.13,50.9 | U7.D17 22.96,25.09 23.03,25.02 23.7,25.02 23.93,25.25 v23.93,26.01
  Bottom 0.203: v24.13,50.9 23.11,49.89 23.11,47.37 24.26,46.23 27.56,46.23 28.83,44.96 28.83,40.81 28.86,40.78 28.86,36.24 29.44,35.66 29.44,33.66 29.39,33.61 29.39,30.81 28.33,29.74 24.92,29.74 23.93,28.75 v23.93,26.01
  Bottom 0.254: D17.1 24.13,49.53 v24.13,50.9
ARTEMIS_D18  (via drill 0.3)
  Top 0.203: v20.95,49.66 21.1,49.8 J1.19 | v19.05,26.14 20.85,26.14 U7.~D18
  Bottom 0.203: v20.95,49.66 18.41,47.12 18.41,43.18 19.3,42.3 26.03,42.3 26.8,41.53 26.8,32.13 25.4,30.73 24.38,30.73 22.94,29.29 20.88,29.29 19.05,27.46 v19.05,26.14
ARTEMIS_D19  (via drill 0.3)
  Top 0.203: v40.87,17.42 40.97,17.32 40.97,12.01 42.04,10.95 43.16,10.95 45.07,9.03 R21.2 | U7.~D19 24.16,26.59 24.66,26.09 24.66,21.49 v24.64,21.46
  Bottom 0.203: v24.64,21.46 24.86,21.24 34.01,21.24 37.82,17.42 v40.87,17.42
ARTEMIS_D22  (via drill 0.3)
  Top 0.203: v30.37,34.82 30.51,34.82 32.13,33.2 32.13,28.83 31.52,28.22 31.52,26.3 30.31,25.09 U7.~D22
  Top 0.254: v30.99,44.32 30.99,43.59 R14.1
  Top 0.305: U3.3 31.41,44.75 v30.99,44.32
  Bottom 0.203: v30.99,44.32 30.99,40.01 30.37,39.38 v30.37,34.82
ARTEMIS_D24  (via drill 0.3)
  Top 0.203: v27.99,36.57 28.62,35.94 29.98,35.94 32.51,33.4 32.51,28.53 31.85,27.87 31.85,26.11 30.33,24.59 U7.~D24 | J1.6 23.9,44.63 23.78,44.76 v23.72,44.76
  Bottom 0.203: TX1.1 20.32,43.51 22.07,45.26 23.22,45.26 v23.72,44.76 26.75,44.76 27.99,43.52 v27.99,36.57
ARTEMIS_D25  (via drill 0.3)
  Top 0.203: U7.~D25 27.9,28.88 27.51,29.28 v27.51,30.25 | v23.01,50.8 23.5,50.32 J1.7
  Bottom 0.203: v23.01,50.8 22.61,50.39 22.61,47.24 22.68,47.17 | 22.68,47.17 24,45.85 27.43,45.85 28.5,44.78 28.5,40.67 28.53,40.65 28.53,36.1 29.06,35.57 29.06,31.25 28.06,30.25 v27.51,30.25 | RX1.1 21.23,45.72 22.68,47.17
ARTEMIS_D26  (via drill 0.3)
  Top 0.203: U7.~D26 26.9,28.73 26.5,29.14 26.5,32.56 26.98,33.04 28.94,33.04 29.12,32.86 30.32,32.86 v30.48,33.02 | R17.1 41.03,42.89 40.93,42.98 Q2.1
  Top 0.305: R17.1 40.55,41.02 40.11,40.59 v39.26,40.59
  Bottom 0.203: v39.26,40.59 39.26,39.77 37.47,37.97 31.54,37.97 31.17,37.61 31.17,33.71 v30.48,33.02
ARTEMIS_D27  (via drill 0.3)
  Top 0.203: U2.4 8.38,54.99 7.61,54.22 R5.2 v5.85,54.22 v5.84,54.23 | v25.78,34.54 26.49,34.54 26.76,34.28 30.49,34.28 31.7,33.07 31.7,29.03 31.17,28.5 31.17,26.75 30.51,26.09 U7.~D27
  Bottom 0.203: v5.84,54.23 8,52.07 8,51.05 17.52,41.54 25.08,41.54 25.78,40.84 v25.78,34.54
ARTEMIS_D28  (via drill 0.3)
  Top 0.203: U2.5 8.97,54.03 9.02,53.98 | D2.C 47.77,17.4 v44.45,17.4 | v43.81,21.08 43.69,21.21 v43.69,29.08 | R8.1 8.98,51.47 v8.66,51.16 | v26.29,33.94 30.32,33.94 31.27,32.99 31.27,29.49 v30.86,29.08 30.84,29.06 30.84,27.48 30.44,27.09 U7.~D28
  Top 0.305: 9.02,53.98 9.02,52.28 R8.1
  Bottom 0.203: v43.81,21.08 43.81,17.91 44.32,17.4 v44.45,17.4 | v43.69,29.08 v30.86,29.08 | v8.66,51.16 8.66,50.93 17.67,41.92 25.51,41.92 26.29,41.15 v26.29,33.94
ARTEMIS_D33  (via drill 0.3)
  Top 0.203: v25.4,23.75 U7.~AD33/SWO
  Bottom 0.203: DEBUG.6 35.81,24.77 34.67,23.62 25.53,23.62 v25.4,23.75
ARTEMIS_D34  (via drill 0.3)
  Top 0.203: U7.AD34 24.9,26.64 v24.87,26.6 | v33.02,28.48 35.87,28.48 36.4,29.01 R25.1 36.41,29.77 R30.1
  Bottom 0.203: v24.87,26.6 25.98,27.71 31.37,27.71 32.13,28.48 v33.02,28.48
ARTEMIS_D35  (via drill 0.3)
  Top 0.203: v46.88,34.41 46.88,28.46 v46.86,28.45 | U7.~AD35 30.34,23.59 32.51,25.77 32.51,26.06 32.99,26.54 v33.02,26.54
  Bottom 0.203: v33.02,26.54 34.29,27.81 44.2,27.81 44.83,28.45 v46.86,28.45 | v46.88,34.41 48.02,35.56 SPI.5
ARTEMIS_D37  (via drill 0.3)
  Top 0.203: U7.~D37 22.43,18.09 22.45,18.11 22.97,18.11 v23.48,18.62 | v7.68,10.6 6.74,10.6 3.76,7.62 J13.1
  Bottom 0.203: v23.48,18.62 23.31,18.44 19.9,18.44 18.67,17.21 18.67,16.32 18.05,15.7 10.93,15.7 10.49,16.14 9.79,16.14 9.08,15.42 9.08,14.63 8.05,13.6 8.05,11.25 7.68,10.88 v7.68,10.6
ARTEMIS_D39_SCL4  (via drill 0.3)
  Top 0.203: v32.13,15.37 32.13,18.19 31.73,18.59 U7.~D39 | v43.5,5.22 42.79,5.22 QWIIC.4
  Bottom 0.203: v32.13,15.37 36.83,15.37 37.34,14.86 37.34,8.76 40.88,5.22 v43.5,5.22
ARTEMIS_D40_SDA4  (via drill 0.3)
  Top 0.203: v32.77,16 32.77,18.57 32.24,19.09 U7.D40 | QWIIC.3 41.75,5.23 v41.75,6.29
  Bottom 0.203: v41.75,6.29 41.06,6.99 39.75,6.99 37.72,9.02 37.72,14.96 36.68,16 v32.77,16
ARTEMIS_D41  (via drill 0.3)
  Top 0.203: J1.12 22.7,44.63 v22.68,44.65 | U7.D41 20.34,24.09 20.07,24.36 20.07,25.4 v20.29,25.62
  Bottom 0.203: v22.68,44.65 22.78,44.65 23.88,43.56 26.29,43.56 27.19,42.66 27.19,31.98 25.33,30.12 24.54,30.12 23.16,28.75 21.34,28.75 20.29,27.71 20.29,26.64 | v20.29,25.62 20.29,26.64 | 20.29,26.64 D41.1
ARTEMIS_D42  (via drill 0.3)
  Top 0.203: U7.~D42 20.39,20.09 19.55,20.93 18.85,20.93 17.35,22.44 17.35,23.08 15.15,25.28 v13.7,25.28
  Bottom 0.203: v13.7,25.28 13.7,26.05 14.07,26.42 14.07,27.92 14.89,28.74 14.89,35.36 13.76,36.49 11.44,36.49 10.89,37.04 10.89,40.24 8.94,42.19 8.94,44.83 2.97,50.8 J10.2
ARTEMIS_D43  (via drill 0.3)
  Top 0.203: U7.~D43 20.38,20.59 19.71,21.26 18.99,21.26 17.68,22.57 17.68,23.46 15.33,25.81 v14.21,25.81
  Bottom 0.203: v14.21,25.81 14.4,26 14.4,27.79 15.24,28.62 15.24,35.48 13.87,36.84 11.55,36.84 11.24,37.16 11.24,40.36 9.31,42.29 9.31,45.01 1.27,53.05 J10.3
ARTEMIS_D44  (via drill 0.3)
  Top 0.203: R19.1 v40.41,9.92 39.69,9.92 39.46,9.69 Q6.1 | U7.~D44 22.64,17.59 v22.66,17.6
  Bottom 0.203: v22.66,17.6 23.29,16.97 31.47,16.97 31.95,17.45 35.74,17.45 38.23,14.96 38.23,11.12 39.43,9.92 v40.41,9.92
ARTEMIS_RX0  (via drill 0.3)
  Top 0.203: R2.1 7.21,12.71 8.32,11.61 v8.81,11.61 10.39,11.61 12.57,13.79 U1.8 | U7.RXI-0 28.34,18.09 v28.32,18.11
  Bottom 0.203: v8.81,11.61 8.81,13.89 RX0.1 10.29,15.37 18.19,15.37 19,16.18 19,17.07 20.04,18.11 v28.32,18.11
ARTEMIS_SWDCK  (via drill 0.3)
  Top 0.203: v25.91,25.27 25.91,19.77 25.91,19.48 27.8,17.59 U7.SWDCK
  Bottom 0.203: DEBUG.4 35.56,26.04 33.66,24.13 28.96,24.13 27.81,25.27 v25.91,25.27
ARTEMIS_SWDIO  (via drill 0.3)
  Top 0.203: v26.67,25.78 26.67,23.24 27.05,22.86 27.05,22.43 27.89,21.59 U7.SWDIO
  Bottom 0.203: DEBUG.2 46.86,27.3 46.23,26.67 35.56,26.67 33.4,24.51 29.21,24.51 27.94,25.78 v26.67,25.78
ARTEMIS_TX0  (via drill 0.3)
  Top 0.203: U1.9 12.07,14.23 v11.49,13.64 v11.48,13.64 10.95,13.11 R3.1 | v33.37,16.64 33.86,17.12 33.86,22.55 33.38,23.04 32.89,23.04 30.95,21.09 U7.TXO-0
  Bottom 0.203: TX0.1 11.11,13.64 v11.48,13.64 12.44,14.61 17.17,14.61 18.85,12.93 28.24,12.93 28.26,12.95 30.73,12.95 31.19,13.41 31.19,15.82 32,16.64 v33.37,16.64
CC3
  Top 0.203: J2.B5 12.54,8.57 R4.2
CC4
  Top 0.203: J2.A5 9.54,8.51 R20.2
D+2
  Top 0.203: J2.A6 10.54,5.33 10.67,5.21 11.43,5.21 11.56,5.33 11.56,6.12 J2.B6 11.57,6.17 U1.1
D-2
  Top 0.203: J2.A7 11.04,7.62 | 11.04,7.62 11.04,11.3 11.3,11.56 11.81,11.56 12.07,11.29 U1.2 | J2.B7 10.04,7.38 10.29,7.62 11.04,7.62
EXT_PWR  (via drill 0.3)
  Top 0.203: v42.65,56.5 42.65,56.37 | v43.2,30.15 43.18,30.13 43.18,20.51 R13.2 | J1.2 J1.1 24.74,48.32 25.32,48.32
  Top 0.254: U11.2 39.48,45.77 v39.5,45.76
  Top 0.305: v27.18,47.5 27.18,48.32 | U5.4 42.38,56.09 42.65,56.37 | v43.2,30.15 43.56,30.51 43.56,36.58 44.32,37.34 45.59,37.34 45.85,37.59 v45.85,38.48
  Top 0.61: 25.32,48.32 27.18,48.32 29.5,48.32 Q1.2
  Bottom 0.305: v27.18,47.5 5V3.1 30.45,45.74 39.48,45.74 v39.5,45.76 40.19,45.76 40.77,45.18 40.77,31.98 40.51,31.73 40.51,30.99 41.35,30.15 v43.2,30.15 | v42.65,56.5 42.92,56.77 46.99,56.77 48.9,54.86 48.9,48.01 48.13,47.24 47.37,47.24 46.74,46.61 46.74,43.43 45.85,42.55 v45.85,38.48
  pour Top (no thermals): 25.02,42.77 24.69,42.77 24.69,49.2 25.37,49.2 25.37,42.77
GND  (via drill 0.25, 0.3)
  Top 0.203: J1.3 24.3,48.26 | U2.8 U2.11 | S1.1 1.27,26.29 v0.89,25.91 | S1.2 6.86,26.29 v7.24,25.91 | v30.48,31.62 29.9,31.04 U7.GND@22 | v49.15,7.24 49.15,8.39 D6.C D4.C D1.C | D3.C 49.06,22.06 DEBUG.9 49.02,22.23 49.68,22.89 49.68,24.23 49.15,24.77 DEBUG.5 DEBUG.3 | v38.86,4.32 38.86,4.83 39.24,5.21 QWIIC.1 | U4.3 44.22,52.28 43.64,52.86 v43.64,53.19 42.43,53.19 C11.2 | U4.5 45.22,52.2 45.87,52.86 v45.87,53.19 46.71,53.19 46.23,52.7 | 46.23,52.7 46.74,52.7 | 46.74,52.7 v48.26,52.7 48.26,51.94 | 48.26,51.94 48.26,51.44 | 48.26,51.44 48.26,50.93 | 48.26,50.93 48.26,50.42 | 48.26,50.42 48.26,50.41 U4.12 | U4.11 48.25,50.91 48.26,50.93 | U4.10 48.24,51.41 48.26,51.44 | U4.9 48.23,51.91 48.26,51.94 | U4.8 46.74,51.94 46.74,52.7 | U4.7 46.22,52.69 46.23,52.7 | v40.01,53.06 40.91,52.16 C11.2 | U5.2 41.15,52.41 C11.2 | U4.29 43.69,49.91 | v48.26,49.53 48.26,50.42 | U4.1 41.65,51.91 C11.2 | U4.17 47.34,47.91 SPI.1 | v42.93,37.72 44.32,39.12 46.23,39.12 46.74,38.61 46.74,37.34 v46.23,36.83 | U4.44 43.92,48.62 v43.92,48.49 | v43.92,48.49 43.69,48.72 43.69,49.91 | v43.92,48.49 44.22,48.49 U4.23 | 45.72,48.51 44.2,48.51 44.22,48.49 | 45.72,48.51 v46.6,48.51 46.61,48.52 | U4.40 46.61,48.52 | 46.61,48.52 v46.61,48.51 | U4.41 45.72,48.51 | U4.46 43.69,49.91 | U4.31 43.57,50.91 43.69,50.8 43.69,50.42 | 43.69,50.42 43.69,49.91 | U4.47 43.69,50.41 43.69,50.42 | U4.37 v46.61,51.31 46.61,50.42 | 19.43,15.62 19.81,15.24 | 39.7,15.29 39.88,15.11 | 46.61,50.42 46.61,49.91 | 46.61,49.91 46.61,49.4 | 46.61,49.4 46.61,48.52 | U4.39 46.6,49.41 46.61,49.4 | U4.38 46.6,49.91 46.61,49.91 | U4.49 46.6,50.41 46.61,50.42 | C19.1 21.46,35.18 21.97,35.69 v21.97,38.23
  Top 0.203: 21.9,47.41 J1.15 21.9,49.56 21.95,49.61 22.3,49.25 J1.13 22.3,47.35 21.9,46.95 21.9,47.41 | 21.9,47.41 v21.67,47.17 | J1.8 23.5,44.19 23.19,44.5 23.19,45.06 | J1.14 22.3,44.3 22.1,44.5 | J1.3 24.3,49.73 | J1.3 24.3,47.44 v24.08,47.22 | 23.93,45.29 24.3,44.91 J1.4 24.3,42.36
  Top 0.305: C22.2 17.23,35.76 v16.47,35 | C23.2 17.3,34.29 v16.49,33.48 17.25,32.72 C20.1 | v11.56,42.16 11.61,42.11 C12.2 | C27.2 5.33,35.73 v5.33,35.05 5.33,34.04 4.95,33.66 U10.2 2.81,33.66 C21.2 1.91,30.95 C29.2 1.36,30.7 1.02,30.35 1.02,27.18 S1.1 S1.2 | C9.2 30.18,41.86 v29.34,41.02 | v9.91,53.77 U2.11 9.91,57.1 9.18,57.82 | C4.2 9.18,57.82 | 9.18,57.82 v9.14,57.78 | v33.12,10.24 33.12,7.62 33.4,7.62 | 33.4,7.62 33.4,7.4 J3.1 | v35.56,7.62 33.4,7.62 | v24.13,6.6 24,6.6 J5.1 | J2.GND 7.57,6.91 7.24,7.24 v6.6,7.24 | J2.GND2 14.02,6.91 14.35,7.24 v14.99,7.24 | Q4.2 39.1,32.02 v39.37,31.75
  Top 0.508: J5.1 23.23,10.18 v23.14,10.26
  Top 0.813: C6.- 19.08,54.83 SC2-.1
  Bottom 0.203: v42.93,33.53 43.94,33.53 44.7,34.29 44.7,35.94 45.59,36.83 v46.23,36.83 | v37.82,47.14 37.82,47.37 34.8,47.37 v31.37,50.8 | v43.31,44.45 43.05,44.45 42.16,45.34 42.16,46.74 v43.92,48.49
  other vias: 23.17,38.27 9.91,31.88 12.93,47.44 5.53,49.85 12.8,54.33 15.79,16.27 13.74,11.71 14.88,17.73 8.16,35.79 19.56,19.56 25.4,19.81 19.56,25.4 18.01,30.91 34.8,19.43 28.47,12.45 6.02,19.15 6.05,21.84 3.81,21.59 3.81,19.05 38.99,51.94 38.99,48.39 36.2,48.39 36.2,51.94 36.83,58.67 41.91,58.67 43.18,57.53 45.97,54.86 41.02,24 45.47,24 34.67,31.5 23.24,25.53 26.19,26.52 27.91,26.54 32.59,27.89 31.75,37.34 31.75,36.32 15.26,38.2 14.39,39.26 17.01,38.18 18.8,38.23 16.42,36.37 10.75,35.78 17.09,43.41 15.04,45.43 18.41,48.9 14.11,40.66 9.21,46.4 7.2,48.23 5.39,56.78 3.11,52.36 13.75,58.93 16.25,57.6 11.1,60.19 16.84,61.35 25.27,61.85 6.69,59.13 33.66,61.72 25.4,54.61 35.94,54.74 44.45,60.96 49.53,51.31 39.37,34.29 35.81,34.29 43.59,41.91 20.32,44.45 26.04,43.03 26.54,44.07 27.05,45.21 46.74,42.42 42.93,35.69 48.77,28.83 36.45,14.48 39.7,16.31 38.91,12.12 32.38,4.32 41.4,2.54 27.3,6.22 19.68,6.48 17.02,2.03 22.23,2.54 27.3,2.54 32.38,2.41 19.94,10.03 14.99,12.57 3.81,6.35 2.66,6.54 6.02,12.66 3.94,25.4 0.76,33.66 0.89,29.84 2.92,36.83 3.05,39.37 6.54,9.04 13.06,9.4 12.32,12.19 16.26,21.08 17.78,17.65 17.53,29.08 12.19,31.62 14.03,34.3 31.75,38.61 35.05,38.61 32.94,44.04 39.62,38.99 26.67,50.67 30.48,53.34 30.91,17.53 49.78,5.08 45.31,2.79 44.58,7.59 43.05,12.32 45.16,9.91 42.42,17.4 46.1,21.34 3.43,41.91 15.82,23.23 19.18,23.37 16.13,26.92 17.78,24.75 48.77,56.64 37.21,38.99 31.37,48.39 22.99,19.94 31.75,13.97 11.56,25.78 7.75,1.27 13.84,1.27 15.82,6.88 23.19,12.37 22.73,32.13 20.32,33.53 12.95,27.45 7.24,31.62 3.81,9.4 38.44,41.86 37.91,44.56 34.92,44.53 18.21,12.09 9.52,13.66 6.16,46.14 5.4,47.03 3.37,49.44 3.49,47.03 9.97,51.22 8.45,53.51 6.29,54.9 5.56,62.12 1.5,58.19
  pour Bottom (rank 2): 0,0 0,63.5 50.8,63.5 50.8,0
  pour Top (rank 2): 0,0 0,63.5 50.8,63.5 50.8,0
  pour Top (isolate 0.102): 34.8,47.37 34.8,63.5 47.75,63.5 47.75,47.37
  pour Bottom (isolate 0.102): 34.8,47.37 34.8,63.5 47.75,63.5 47.75,47.37
GNSS
  Top 0.203: 44.7,52.7 44.7,51.93 arc90 U4.4
  Top 0.813: C15.2 44.7,52.7
IRIDIUM
  Top 0.813: J6.FEED C14.2
LTC3225_VOUT
  Top 0.203: 10.85,58.89 C4.1 | U2.10 10.85,56.54 10.92,56.62
  Top 0.305: 10.92,58.81 10.85,58.89
  Top 0.406: 10.92,56.62 10.92,58.81
  Top 0.508: U3.6 34.02,50.82 33.8,51.04 R9.2
  Top 0.61: SC1+.1 33.1,53.39 R9.2 | C5.+ 31.72,59.97 31.24,60.45 12.41,60.45 C4.1
  Top 0.813: C5.+ 31.72,54.77 SC1+.1
N$1  (via drill 0.3)
  Top 0.203: U2.3 7.75,55.5 v7.49,55.24
  Top 0.813: SC2+.1 22.58,53.94 v22.58,55.75 C6.+ C5.- 28.22,53.94 SC1-.1
  Bottom 0.203: v7.49,55.24 8.89,56.64 21.69,56.64 v22.58,55.75
N$2  (via drill 0.3)
  Top 0.305: v12.12,50.95 12.42,50.65 13.19,50.65 R6.2
  Bottom 0.203: JP1.3 12.45,51.28 v12.12,50.95
N$3  (via drill 0.3)
  Top 0.203: v44.7,12.57 45.74,12.57 46.04,12.87 R1.1
  Bottom 0.203: v44.7,12.57 45.25,13.12 JP2.2
N$4  (via drill 0.3)
  Top 0.305: v16.13,51.69 15.11,50.67 R7.1
  Bottom 0.203: JP1.1 15.47,53.37 16.13,52.7 v16.13,51.69
N$5
  Top 0.203: R12.1 D2.A
N$6
  Top 0.203: R13.1 D3.A
N$7
  Top 0.203: D5.A 38.71,11.03 Q6.3
N$8
  Top 0.508: U3.5 33.27,46.48 33.1,46.66 R9.1 Q1.3
N$9
  Top 0.203: U2.2 7.41,56.01 C3.2
N$10
  Top 0.203: C3.1 7.66,58.13 8,57.78 8,56.77 8.28,56.49 U2.1
N$11  (via drill 0.3)
  Top 0.203: v11.64,55.47 11.64,55.22 11.41,54.99 U2.7
  Bottom 0.203: JP1.2 12.55,52.32 11.64,53.24 v11.64,55.47
N$12  (via drill 0.3)
  Top 0.203: Q1.1 29.56,51.17 v29.64,51.26 | R10.1 35.72,47.44 35.92,47.24 v35.92,46.84
  Bottom 0.203: v29.64,51.26 29.64,48.08 30.89,46.84 v35.92,46.84
N$13
  Top 0.203: R10.2 35.23,45.75 35.01,45.53 U3.4
  Top 0.254: U3.4 34.02,44.22 R11.1
N$14
  Top 0.254: R11.2 33.98,42.01 33.83,41.86 C9.1
N$15
  Top 0.305: U3.1 30.5,47.43 C10.1
N$16
  Top 0.203: L1.2 41.4,47.75 41.66,48.01 42.29,48.01 42.7,48.41 U4.26
N$17
  Top 0.203: C11.1 L1.1 43.21,48.91 U4.27
N$18
  Top 0.203: U4.18 46.72,47.03 47.1,46.65 X2.P$2
N$19
  Top 0.203: U4.19 46.22,46.47 44.96,45.21 X2.P$1
N$20
  Top 0.203: D5.C 36.61,7.99 36.12,8.48 R15.2
N$21
  Top 0.203: R16.1 D4.A
N$22
  Top 0.203: D13.C 7.19,14.16 R2.2
N$23  (via drill 0.3)
  Top 0.203: v46.48,12.45 46.99,12.45 47.31,12.76 D1.A
  Bottom 0.203: v46.48,12.45 46.29,12.64 JP2.1
N$24  (via drill 0.3)
  Top 0.203: U4.16 48.23,48.41 v48.26,48.39 | v45.26,37.97 44.32,37.97 42.92,36.57 D11.C D12.C
  Bottom 0.203: v48.26,48.39 47.24,48.39 46.23,47.37 46.23,43.56 45.26,42.6 v45.26,37.97
N$25  (via drill 0.25)
  Top 0.203: U4.34 44.72,50.99 44.45,51.26 v44.45,51.44
  Bottom 0.203: v44.45,51.44 43.81,51.44 SAFEBOOT.1
N$26  (via drill 0.3)
  Top 0.203: U4.22 44.72,47.66 44.43,47.37 43.69,47.37 v43.43,47.12
  Bottom 0.203: v43.43,47.12 43.43,45.97 GPS_RX.1
N$27  (via drill 0.3)
  Top 0.203: U4.21 45.22,47.63 v44.32,46.74
  Bottom 0.203: v44.32,46.74 44.32,44.32 GPS_TX.1
N$28
  Top 0.406: U5.1 arc-90 40.45,53.85 39.75,53.85
  Top 0.813: C14.1 38.39,55.71 arc-90 39.12,54.99 39.12,54.48 arc90 39.75,53.85
N$29
  Top 0.406: 42.55,53.85 41.84,53.85 arc-90 U5.3
  Top 0.813: C15.1 43.9,55.71 arc90 43.18,54.99 43.18,54.48 arc-90 42.55,53.85
N$30
  Top 0.406: 41.15,57.75 C16.2 | 41.15,57.15 U5.5
  Top 0.813: C16.2 41.15,57.75 41.15,57.15
N$31  (via drill 0.3)
  Top 0.254: U12.4 38.21,43.52 40.16,45.47 40.16,46.29 R31.1 39.67,46.67 v39.12,47.22
  Top 0.305: U5.6 40.13,56.09 v39.77,56.45
  Bottom 0.305: v39.77,56.45 39.55,56.67 35.84,56.67 34.98,55.8 34.98,48.72 35.92,47.78 38.56,47.78 v39.12,47.22
N$32
  Top 0.203: D7.C 8.74,14.14 R3.2
N$33
  Top 0.203: U12.2 36.88,44.32 37.44,44.88 37.44,46.3 37.32,46.42 U11.4
N$35
  Top 0.203: R21.1 D6.A
N$36  (via drill 0.3)
  Top 0.203: U10.3 3.37,32.7 3.17,32.52 v3.17,31.88
  Bottom 0.203: v3.17,31.88 3.17,16.51 3.81,15.88 3V3EN.2
  Bottom 0.406: EN.1 3.8,15.24 3V3EN.2
N$37
  Top 0.305: Q4.3 37.34,35.97 Q3.1 37.39,36.02 R22.1
N$39
  Top 0.203: U9.5 17.26,13.92 16.91,14.28 15.6,14.28 15.09,14.78 15.09,16.31 15.78,17 R28.2
N$40
  Top 0.203: D9.C 16.1,13.37 R29.2
N$41
  Top 0.203: R29.1 16.57,10.8 16.84,11.07 U9.1
N$46
  Top 0.305: R24.1 35.23,36.92 Q3.3
N$47
  Top 0.203: R25.2 Q4.1
V_AAA
  Top 0.508: J3.2 31.39,10.35 30.04,11.69 D10.A
V_BATT
  Top 0.508: J5.2 21.23,9.89 20.05,11.07 U9.3 19.16,9.69 18.62,9.15 D8.A 16.76,9.61 16.53,9.84 C8.1
V_BCKP  (via drill 0.3)
  Top 0.203: v41.88,12.32 41.88,19.91 42.64,20.67 42.64,30.78 42.88,31.01 42.88,31.55 D12.A | B1.+ 35.19,11.21 R15.1 36.67,10.28 37.95,11.56 39.65,11.56 v40.39,12.29
  Bottom 0.203: v41.88,12.32 41.86,12.29 v40.39,12.29
V_USB
  Top 0.203: C17.1 18.85,15.29 18.71,15.15
  Top 0.305: J2.VBUS2 13.24,5.52 12.95,5.23 12.95,3.56 | J2.VBUS1 8.35,5.52 10.29,3.58 10.29,3.56
  Top 0.508: 25.15,11.53 25.3,11.69 D14.A 20.57,11.69 19.96,12.29 19.48,12.29 19.15,12.62 U9.4 19.16,14.7 18.71,15.15 D9.A
  Top 0.813: 25.15,11.53 25.15,5.74 23.6,4.19 20.85,4.19 20.22,4.83 17.4,4.83 16.13,3.56 12.95,3.56 10.29,3.56
VBUS  (via drill 0.4)
  Top 0.61: v18.82,8.13 18.82,7.26 18.41,6.85 D8.C
  Top 0.813: D10.C 28.45,8.64 v27.94,8.13 v26.67,8.13 26.42,8.38 D14.C | v19.71,8.13 v18.82,8.13
  Bottom 0.406: MEAS.1 3.82,10.16 J4.2
  Bottom 0.813: J4.2 3.3,8.13 v18.82,8.13 | v19.71,8.13 v26.67,8.13 v27.94,8.13
VIN  (via drill 0.3, 0.4)
  Top 0.305: v22.61,39.12 22.73,39.24 35.69,39.24 37.02,37.91 Q3.2 38.95,37.91 39.22,37.64 R22.2 | v6.92,44.52 10.68,44.52 v10.69,44.51
  Top 0.61: U10.1 4.03,34.7 v3.17,35.56 2.03,35.56 1.91,35.43 C21.1
  Bottom 0.305: v3.17,35.56 4.57,36.96 4.57,40.51 6.92,42.87 v6.92,44.52 | v22.61,39.12 17,39.12 11.61,44.51 v10.69,44.51
  Bottom 0.406: 3.83,12.7 MEAS.2 | 3V3EN.1 3.81,12.7
  Bottom 0.61: J4.1 3.81,12.7 3.83,12.7 5.08,12.7
  Bottom 0.813: 5.08,12.7 5.08,33.66 v3.17,35.56 v1.91,35.56
XTALI
  Top 0.203: C19.2 21.48,32.78 X1.P$1 22.23,30.61 22.9,29.93 U7.XI
XTALO
  Top 0.203: U7.XO 23.4,28.73 23.98,29.32 23.98,30.48 | 23.98,30.48 X1.P$2 | C18.2 24,30.5 23.98,30.48

## Text on the board
Bottom: v10
tPlace: + | + | + | - | + | -
bPlace: - | - | - | - | - | - | + | +
Measures: UNITS IN INCHES
tDocu: Paul Clark | Revised by: Pete Lewis